# Altium schematic sheet Conectors.SchDoc
size A; SheetNumber: 3; SheetTotal: 6
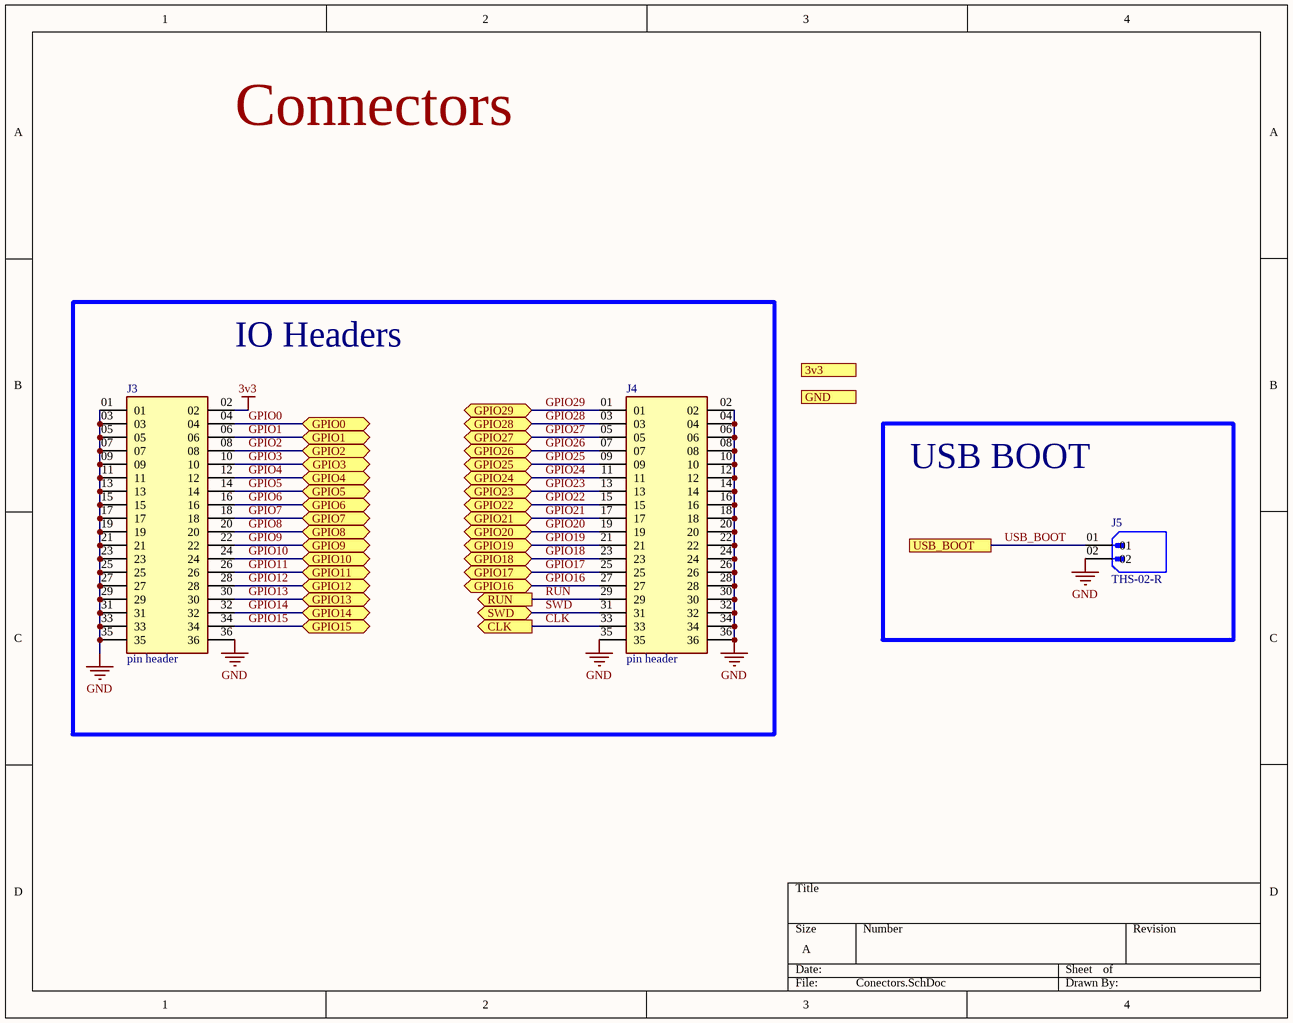
[diagram p0: Conectors.SchDoc]

## Parts
J3  pin header  [MTSW-118-07-T-D-150]
J4  pin header  [MTSW-118-07-T-D-150]
J5  THS-02-R  [THS-02-R]

## Blocks framed on the sheet
IO Headers: J3 J4
USB BOOT: J5

## Ports
3v3, CLK (out), GND, GPIO0 (bidir), GPIO1 (bidir), GPIO2 (bidir), GPIO3 (bidir), GPIO4 (bidir), GPIO5 (bidir), GPIO6 (bidir), GPIO7 (bidir), GPIO8 (bidir), GPIO9 (bidir), GPIO10 (bidir), GPIO11 (bidir), GPIO12 (bidir), GPIO13 (bidir), GPIO14 (bidir), GPIO15 (bidir), GPIO16 (bidir), GPIO17 (bidir), GPIO18 (bidir), GPIO19 (bidir), GPIO20 (bidir), GPIO21 (bidir), GPIO22 (bidir), GPIO23 (bidir), GPIO24 (bidir), GPIO25 (bidir), GPIO26 (bidir), GPIO27 (bidir), GPIO28 (bidir), GPIO29 (bidir), RUN (out), SWD (bidir), USB_BOOT

## Nets
3v3: J3.02
GND: J3.01 J3.03 J3.05 J3.07 J3.09 J3.11 J3.13 J3.15 J3.17 J3.19 J3.21 J3.23 J3.25 J3.27 J3.29 J3.31 J3.33 J3.35 J3.36 J4.02 J4.04 J4.06 J4.08 J4.10 J4.12 J4.14 J4.16 J4.18 J4.20 J4.22 J4.24 J4.26 J4.28 J4.30 J4.32 J4.34 J4.35 J4.36 J5.02
CLK: J4.33 ; port CLK
GPIO0: J3.04 ; port GPIO0
GPIO1: J3.06 ; port GPIO1
GPIO2: J3.08 ; port GPIO2
GPIO3: J3.10 ; port GPIO3
GPIO4: J3.12 ; port GPIO4
GPIO5: J3.14 ; port GPIO5
GPIO6: J3.16 ; port GPIO6
GPIO7: J3.18 ; port GPIO7
GPIO8: J3.20 ; port GPIO8
GPIO9: J3.22 ; port GPIO9
GPIO10: J3.24 ; port GPIO10
GPIO11: J3.26 ; port GPIO11
GPIO12: J3.28 ; port GPIO12
GPIO13: J3.30 ; port GPIO13
GPIO14: J3.32 ; port GPIO14
GPIO15: J3.34 ; port GPIO15
GPIO16: J4.27 ; port GPIO16
GPIO17: J4.25 ; port GPIO17
GPIO18: J4.23 ; port GPIO18
GPIO19: J4.21 ; port GPIO19
GPIO20: J4.19 ; port GPIO20
GPIO21: J4.17 ; port GPIO21
GPIO22: J4.15 ; port GPIO22
GPIO23: J4.13 ; port GPIO23
GPIO24: J4.11 ; port GPIO24
GPIO25: J4.09 ; port GPIO25
GPIO26: J4.07 ; port GPIO26
GPIO27: J4.05 ; port GPIO27
GPIO28: J4.03 ; port GPIO28
GPIO29: J4.01 ; port GPIO29
RUN: J4.29 ; port RUN
SWD: J4.31 ; port SWD
USB_BOOT: J5.01 ; port USB_BOOT

## Notes on the sheet
- Connectors

## Library data of the parts
J3 J4 = MTSW-118-07-T-D-150: 2x18 male pin header; Package: None; Price: None; Value: *; MP: MTSW-118-07-T-D-150; Availability: Unavailable
J5 = THS-02-R: 2x1 male pin header; Value: *; Price: None; Package: None; Availability: Unavailable; MP: THS-02-R